# Altium schematic sheet Sheet1.SchDoc
size A3
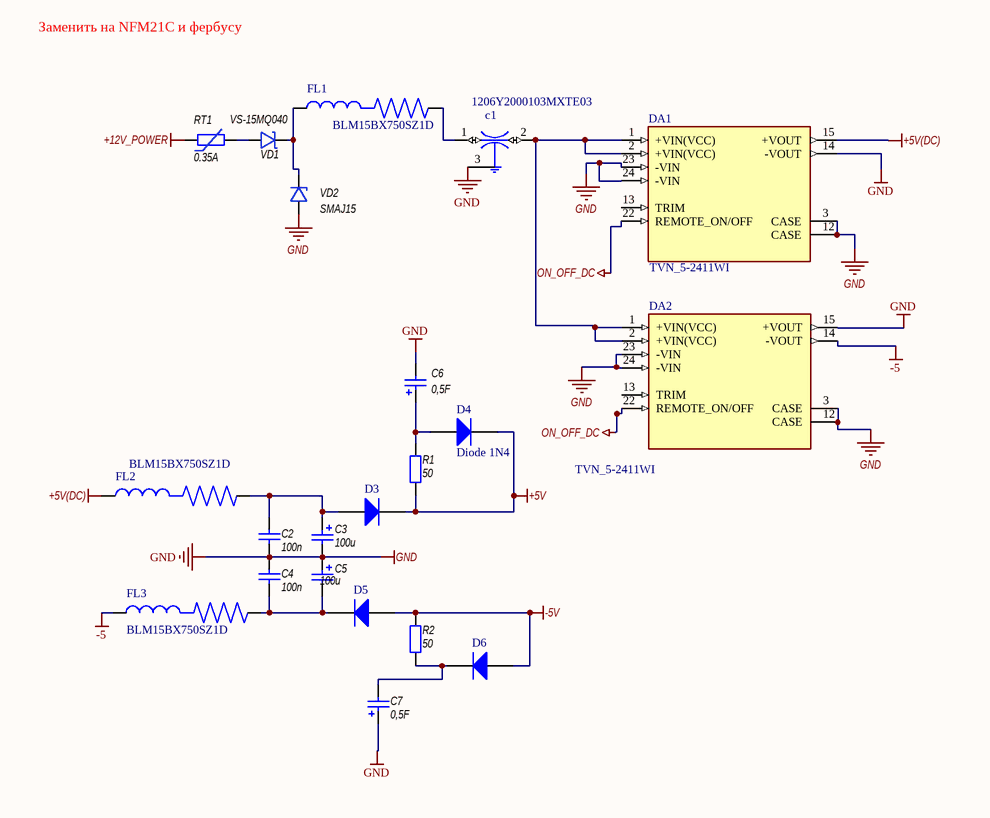
[diagram p0: Sheet1.SchDoc]

## Parts
c1  1206Y2000103MXTE03  [FIL_NFM41PC155B1E3L]
C2  100n  [CAP_0603]
C3  100u  [CAPPM7343X310N]
C4  100n  [CAP_0603]
C5  100u  [CAPPM7343X310N]
C6  0,5F  [EECF5R5U474, 0.470 Ф, 5.5 В, 5мм]
C7  0,5F  [EECF5R5U474, 0.470 Ф, 5.5 В, 5мм]
D3  (no value)  [DO-214AC (SMA)]
D4  Diode 1N4  [DO-214AC (SMA)]
D5  (no value)  [DO-214AC (SMA)]
D6  (no value)  [DO-214AC (SMA)]
DA1  TVN_5-2411WI  [CONV_TVN_5-2415WI]
DA2  TVN_5-2411WI  [CONV_TVN_5-2415WI]
FL1  BLM15BX750SZ1D  [BEADC2012X105N]
FL2  BLM15BX750SZ1D  [BEADC2012X105N]
FL3  BLM15BX750SZ1D  [BEADC2012X105N]
R1  50  [RES_0805]
R2  50  [RES_0805]
RT1  0.35A  [FUSER_MF-MSMF200-2]
VD1  VS-15MQ040  [DO-214AC (SMA)]
VD2  SMAJ15  [DO-214AC (SMA)]

## Nets
+5V: D3.k D4.k(K) R1.1
+5V(DC): DA1.15(+VOUT) FL2.1
+12V_POWER: RT1.1
-5: DA2.14(-VOUT) FL3.1
-5V: D5.a(A) D6.a(A) R2.2
GND: c1.3(GND) C2.1 C3.2 C4.2 C5.1 C6.2 C7.1 DA1.3(CASE) DA1.12(CASE) DA1.14(-VOUT) DA1.23(-VIN) DA1.24(-VIN) DA2.3(CASE) DA2.12(CASE) DA2.15(+VOUT) DA2.23(-VIN) DA2.24(-VIN) VD2.a(A)
ON_OFF_DC: DA1.22(REMOTE_ON/OFF) DA2.22(REMOTE_ON/OFF)
Netc1_1: c1.1(A) FL1.2
Netc1_2: c1.2(B) DA1.1(+VIN(VCC)) DA1.2(+VIN(VCC)) DA2.1(+VIN(VCC)) DA2.2(+VIN(VCC))
NetC2_2: C2.2 C3.1 D3.a FL2.2
NetC4_1: C4.1 C5.2 D5.k(K) FL3.2
NetC6_1: C6.1 D4.a(A) R1.2
NetC7_2: C7.2 D6.k(K) R2.1
NetFL1_1: FL1.1 VD1.k(K) VD2.k(K)
NetRT1_2: RT1.2 VD1.a(A)

Not connected (* = marked no-connect by the designer): DA1 13(TRIM); DA2 13(TRIM)

## Notes on the sheet
- Заменить на NFM21C и фербусу
- Title
- Size:
- Date:
- A3
- Number:
- Time:
- Revision:
- Sheet
- of
- File:

## Library data of the parts
c1 = 1206Y2000103MXTE03: ÐŸÐ¸Ñ‚Ð°Ð½Ð¸Ðµ Ñ‡ÐµÑ€ÐµÐ· ÐºÐ¾Ð½Ð´ÐµÐ½ÑÐ°Ñ‚Ð¾Ñ€Ñ‹ 1206 200Ð’ .01uF 20% X7R X2y Ñ„Ð¸Ð»ÑŒÑ‚Ñ€; pin to pad: 2>3 3>2; MF: Syfer; Availability: Unavailable; SnapEDA_Link: https://www.snapeda.com/parts/1206Y2000103MXTE03/Syfer/view-part/1659626/?ref=snap; Package: 1206 Syfer; MP: 1206Y2000103MXTE03; Value: *; Price: None
C2 C4 = _capacitor: Model: 0603 100n; Value: 100n
C3 C5 = _capacitor_pol: Model: Чип Тант. 6.3V 100uF 20% C; Value: 100u
C6 C7 = _capacitor_pol: Model: T491C476K016AT; Value: 47u
D3-D6 = Diode 1N4934: 1 Amp Fast Recovery Rectifier; pin to pad: a>1 k>2; Published: 8-Jun-2000; LatestRevisionDate: 17-Jul-2002; LatestRevisionNote: Re-released for DXP Platform.; DatasheetVersion: 1999; PackageVersion: Aug-1999; PackageReference: DO-41; Publisher: Altium Limited; PackageDescription: Diode, Axial; Body 5.2 x 2.7 mm (LxDia. max), Lead Dia. 0.86 mm (max); Code_JEDEC: DO-204-AL; ComponentLink1Description: Manufacturer Link; ComponentLink1URL: http://www.fairchildsemi.com/; ComponentLink2Description: Datasheet; ComponentLink2URL: http://www.fairchildsemi.com/ds/1N%2F1N4934.pdf
DA1 DA2 = TVN_5-2415WI: Isolated Module DC DC Converter 1 Output 24V    208mA 9V - 36V Input; MF: Traco Power; MP: TVN 5-2415WI; SnapEDA_Link: https://www.snapeda.com/parts/TVN%205-2415WI/Traco%20Power/view-part/2758880/?ref=snap; Price: None; Package: DIP-24 Traco Power; Availability: Unavailable; Value: *
FL1-FL3 = BLM15BX750SZ1D: Ñ„ÐµÑ€Ñ€Ð¸Ñ‚Ð¾Ð²Ð°Ñ ÑˆÐ°Ð¹Ð±Ð°; MF: Murata; SnapEDA_Link: https://www.snapeda.com/parts/BLM15BX750SZ1D/Murata/view-part/2734322/?ref=snap; Value: *; MP: BLM15BX750SZ1D; Availability: Unavailable; Package: 1005 Taiyo Yuden; Price: None
R1 R2 = _resistor: Model: 0603 10k; Value: 10k
RT1 = _termistor: Model: MF-MSMD035; Value: 0.35A
VD1 = _diod_schottky: pin to pad: a>1 k>2; Model: VS-15MQ040
VD2 = _diode_zener: pin to pad: a>1 k>2; Model: SMAJ15